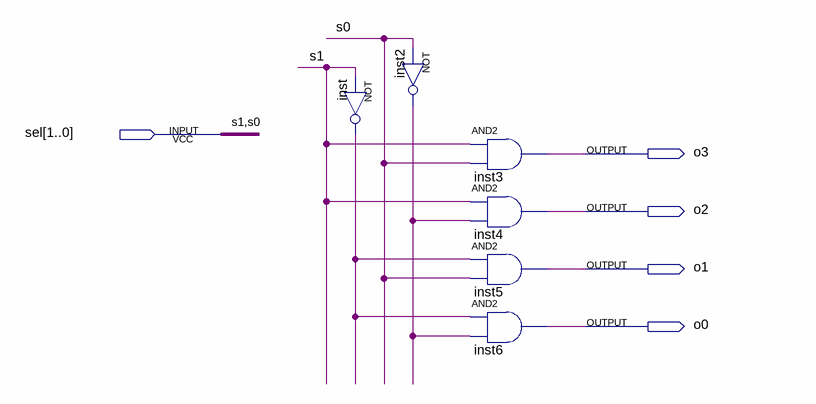
[diagram p0: schematic sheet]
// Quartus schematic Prio24.bdf as structural Verilog: 6 symbols, 5 pins
module Prio24 (
  input  [1:0] sel,
  output o3,
  output o2,
  output o1,
  output o0
);

  wire inst2_out, inst_out;

  not inst2 (inst2_out, sel[0]);
  not inst (inst_out, sel[1]);
  and inst3 (o3, sel[1], sel[0]);
  and inst4 (o2, sel[1], inst2_out);
  and inst5 (o1, inst_out, sel[0]);
  and inst6 (o0, inst_out, inst2_out);

  // Other names for the same wires on the sheet: s0 = sel[0]; s1 = sel[1]
endmodule
